# EAGLE design ExosFeather (EAGLE 7.3.0)
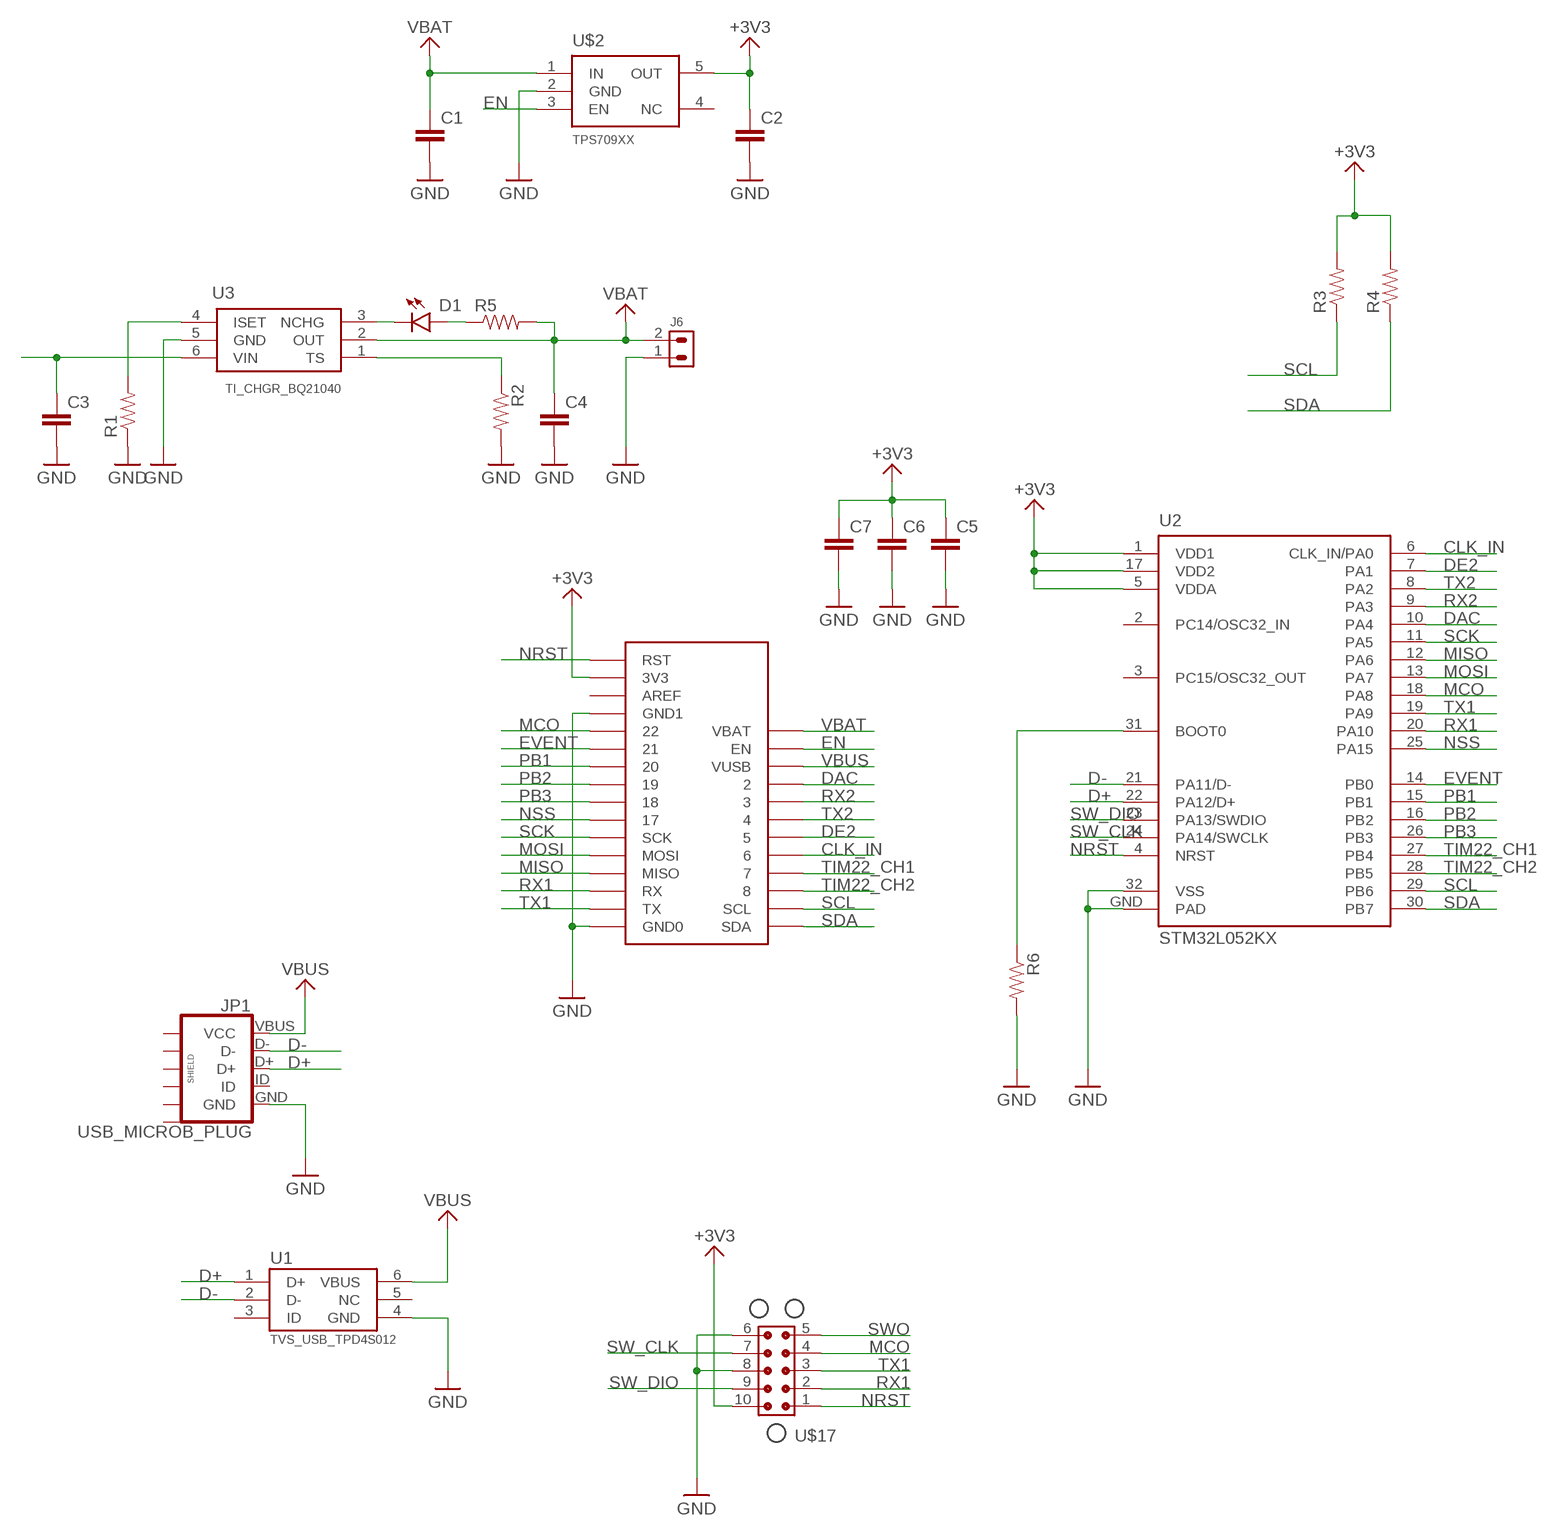
[diagram p0: schematic, sheet 1]

## Parts
C1  0603_CAP  [0603]
C2  0603_CAP  [0603]
C3  0603_CAP  [0603]
C4  0603_CAP  [0603]
C5  0603_CAP  [0603]
C6  0603_CAP  [0603]
C7  0603_CAP  [0603]
D1  0603_LED  [0603_LED]
J6  CONN_2X1_JST_PA  [CONN_2X1_JST_PA]
JP1  USB_MICROB_PLUG  [USB-MICROB]
R1  0603_RES  [0603]
R2  0603_RES  [0603]
R3  0603_RES  [0603]
R4  0603_RES  [0603]
R5  0603_RES  [0603]
R6  0603_RES  [0603]
U1  TVS_USB_TPD4S012  [USB_TVS_TPD4S012]
U2  STM32L052KX  [STM32_QFN_32_5X5]
U3  TI_CHGR_BQ21040  [SOT-23-6_TI]
U$1  FEATHER_PINOUT_FULL  [FEATHER_PINOUT_FULL]
U$2  TPS709XX  [SOT23-5]
U$17  TC_2050_IDC_TOP  [TC_2050_IC_TOP]

## Nets
+3V3: C2.P$1 C5.P$1 C6.P$1 C7.P$1 R3.P$2 R4.P$2 U2.1(VDD1) U2.5(VDDA) U2.17(VDD2) U$1.P$27(3V3) U$2.5(OUT) U$17.10 ; supply symbol labelled SUP_+3V3
CLK_IN: U2.6(CLK_IN/PA0) U$1.P$8
D+: JP1.D+ U1.1(D+) U2.22(PA12/D+)
D-: JP1.D- U1.2(D-) U2.21(PA11/D-)
DAC: U2.10(PA4) U$1.P$4
DE2: U2.7(PA1) U$1.P$7
EN: U$1.P$2(EN) U$2.3(EN)
EVENT: U2.14(PB0) U$1.P$23
GND: C1.P$2 C2.P$2 C3.P$2 C4.P$2 C5.P$2 C6.P$2 C7.P$2 J6.1 JP1.GND R1.P$1 R2.P$2 R6.P$2 U1.4(GND) U2.32(VSS) U2.GND(PAD) U3.5(GND) U$1.P$13(GND0) U$1.P$25(GND1) U$2.2(GND) U$17.6 U$17.8
MCO: U2.18(PA8) U$1.P$24 U$17.4
MISO: U2.12(PA6) U$1.P$16(MISO)
MOSI: U2.13(PA7) U$1.P$17(MOSI)
N$1: R6.P$1 U2.31(BOOT0)
N$3: R2.P$1 U3.1(TS)
N$5: R1.P$2 U3.4(ISET)
N$6: D1.P$2(C) U3.3(NCHG)
N$7: D1.P$1(A) R5.P$1
NRST: U2.4(NRST) U$1.P$28(RST) U$17.1
NSS: U2.25(PA15) U$1.P$19
PB1: U2.15(PB1) U$1.P$22
PB2: U2.16(PB2) U$1.P$21
PB3: U2.26(PB3) U$1.P$20
RX1: U2.20(PA10) U$1.P$15(RX) U$17.2
RX2: U2.9(PA3) U$1.P$5
SCK: U2.11(PA5) U$1.P$18(SCK)
SCL: R3.P$1 U2.29(PB6) U$1.P$11(SCL)
SDA: R4.P$1 U2.30(PB7) U$1.P$12(SDA)
SW_CLK: U2.24(PA14/SWCLK) U$17.7
SW_DIO: U2.23(PA13/SWDIO) U$17.9
SWO: U$17.5
TIM22_CH1: U2.27(PB4) U$1.P$9
TIM22_CH2: U2.28(PB5) U$1.P$10
TX1: U2.19(PA9) U$1.P$14(TX) U$17.3
TX2: U2.8(PA2) U$1.P$6
VBAT: C1.P$1 C4.P$1 J6.2 R5.P$2 U3.2(OUT) U$1.P$1(VBAT) U$2.1(IN) ; supply symbol labelled SUP_VBAT
VBUS: C3.P$1 JP1.VBUS(VCC) U1.6(VBUS) U3.6(VIN) U$1.P$3(VUSB) ; supply symbol labelled SUP_VBUS
Unconnected: JP1.ID JP1.MT1(SHIELD) JP1.MT2(SHIELD1) JP1.P$1(SHIELD2) JP1.P$2(SHIELD3) JP1.P$3(SHIELD4) JP1.P$4(SHIELD5) U1.3(ID) U1.5(NC) U2.2(PC14/OSC32_IN) U2.3(PC15/OSC32_OUT) U$1.P$26(AREF) U$2.4(NC)

## Library data of the parts
C1-C7 = stepOSP:0603_CAP
D1 = stepOSP:0603_LED
J6 = leaf:CONN_2X1_JST_PA
JP1 = stepOSP:USB_MICROB_PLUG: USB Micro-B connectors Some male, some female. Watch your step!
R1-R6 = stepOSP:0603_RES
U1 = leaf:TVS_USB_TPD4S012
U2 = leaf:STM32L052KX
U3 = leaf:TI_CHGR_BQ21040
U$1 = stepOSP:FEATHER_PINOUT_FULL
U$2 = stepOSP:TPS709XX
U$17 = leaf:TC_2050_IDC_TOP

## Board
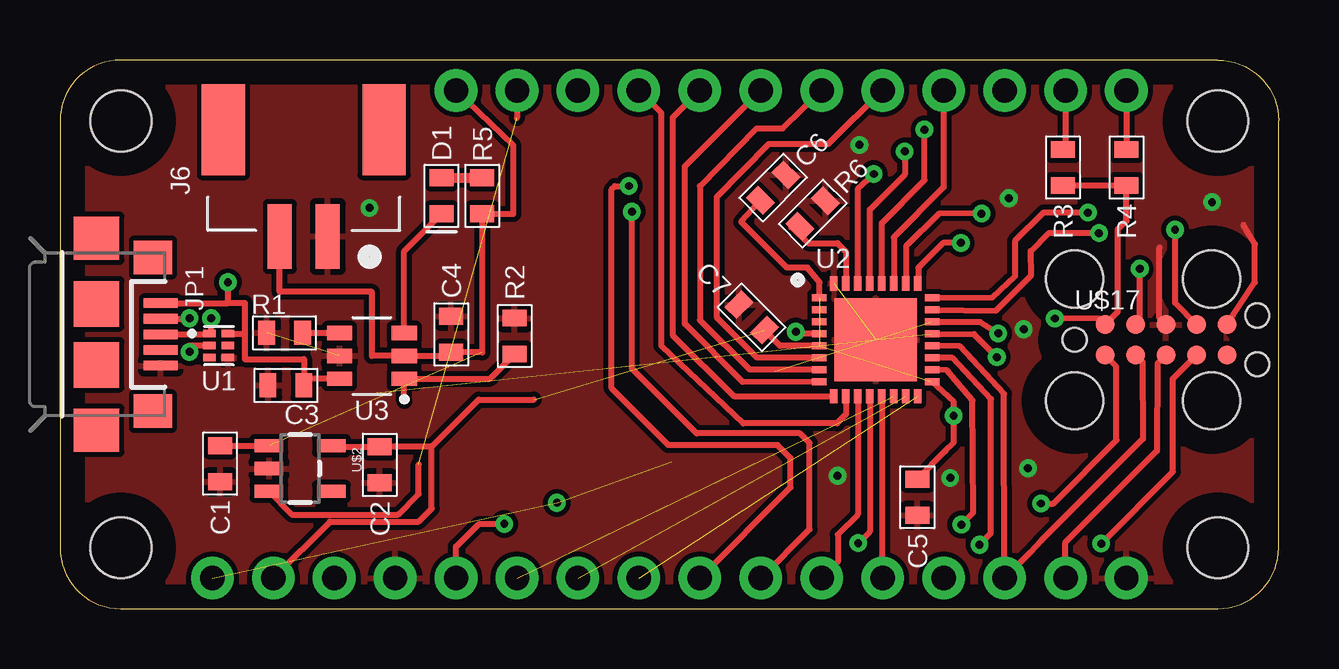
[diagram p1: board, top side]
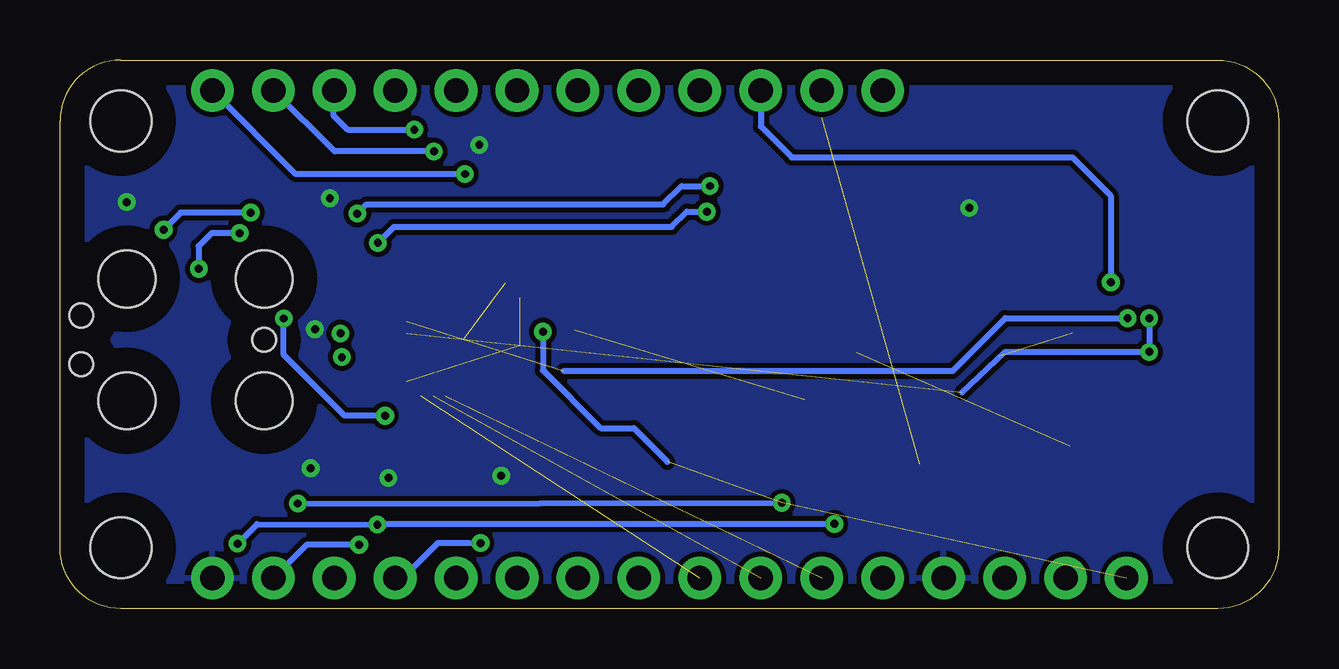
[diagram p2: board, bottom side, seen from below]

Size 50.8 x 22.86 mm. Coordinates in mm from the lower left corner, seen from the top.
Outline: 2.54,0 48.26,0 arc90 50.8,2.54 50.8,20.32 arc90 48.26,22.86 2.54,22.86 arc90 0,20.32 0,2.54 arc90 2.54,0
Copper layers (1*16): Top 0.035mm / dielectric 1.5mm / Bottom 0.035mm
Design rules "default": minimum track width 10mil, minimum drill 24mil, track to track 8mil, track to pad 8mil, pad to pad 8mil, via to via 8mil, smd to smd 8mil, copper to edge 40mil, drill to drill 8mil, minimum pad ring 10mil, minimum via ring 8mil, stop-mask expansion 4mil, vias tented up to drill 0mil, thermal gap 10mil

### Footprints (pad centres in the part's own frame; a part is rotated, then mirrored left to right if it is on the bottom)
0603 = smd 0.7 x 1: P$1 -0.75,0; P$2 0.75,0
0603_LED = smd 0.7 x 1: P$1 -0.75,0; P$2 0.75,0
CONN_2X1_JST_PA = smd 1 x 2.7: 1 1,-9.15; 2 -1,-9.15 | smd 1.8 x 3.8: P$1 3.35,-4.7; P$2 -3.35,-4.7
USB-MICROB = smd 0.4 x 1.4: D+ 0,2.675; D- -0.65,2.675; GND 1.3,2.675; ID 0.65,2.675; VBUS -1.3,2.675 | smd 1.8 x 1.9: MT1 -4,0; MT2 4,0 | smd 1.9 x 1.9: P$1 -1.27,0; P$2 1.27,0 | smd 1.4 x 1.6: P$3 3.2,2.35; P$4 -3.2,2.35
USB_TVS_TPD4S012 = smd 0.52 x 0.3: 1 -0.385,0.5; 2 -0.385,0; 3 -0.385,-0.5; 4 0.385,-0.5; 5 0.385,0; 6 0.385,0.5
STM32_QFN_32_5X5 = smd 0.6 x 0.3: 1 -2.35,1.75; 2 -2.35,1.25; 3 -2.35,0.75; 4 -2.35,0.25; 5 -2.35,-0.25; 6 -2.35,-0.75; 7 -2.35,-1.25; 8 -2.35,-1.75; 17 2.35,-1.75; 18 2.35,-1.25; 19 2.35,-0.75; 20 2.35,-0.25; 21 2.35,0.25; 22 2.35,0.75; 23 2.35,1.25; 24 2.35,1.75 | smd 0.3 x 0.6: 9 -1.75,-2.35; 10 -1.25,-2.35; 11 -0.75,-2.35; 12 -0.25,-2.35; 13 0.25,-2.35; 14 0.75,-2.35; 15 1.25,-2.35; 16 1.75,-2.35; 25 1.75,2.35; 26 1.25,2.35; 27 0.75,2.35; 28 0.25,2.35; 29 -0.25,2.35; 30 -0.75,2.35; 31 -1.25,2.35; 32 -1.75,2.35 | smd 3.45 x 3.45: GND 0,0
SOT-23-6_TI = smd 0.6 x 1.05: 1 -0.95,-1.35; 2 0,-1.35; 3 0.95,-1.35; 4 0.95,1.35; 5 0,1.35; 6 -0.95,1.35
FEATHER_PINOUT_FULL = drill 1.016 pad 1.778: P$1 16.51,21.59; P$2 19.05,21.59; P$3 21.59,21.59; P$4 24.13,21.59; P$5 26.67,21.59; P$6 29.21,21.59; P$7 31.75,21.59; P$8 34.29,21.59; P$9 36.83,21.59; P$10 39.37,21.59; P$11 41.91,21.59; P$12 44.45,21.59; P$13 44.45,1.27; P$14 41.91,1.27; P$15 39.37,1.27; P$16 36.83,1.27; P$17 34.29,1.27; P$18 31.75,1.27; P$19 29.21,1.27; P$20 26.67,1.27; P$21 24.13,1.27; P$22 21.59,1.27; P$23 19.05,1.27; P$24 16.51,1.27; P$25 13.97,1.27; P$26 11.43,1.27; P$27 8.89,1.27; P$28 6.35,1.27 | hole 2.54: 2.54,2.54; 2.54,20.32; 48.26,20.32; 48.26,2.54
SOT23-5 = smd 0.55 x 1.2: 1 -0.95,-1.3; 2 0,-1.3; 3 0.95,-1.3; 4 0.95,1.3; 5 -0.95,1.3
TC_2050_IC_TOP = smd 0.787 x 0.787: 1 -2.54,-0.635; 2 -1.27,-0.635; 3 0,-0.635; 4 1.27,-0.635; 5 2.54,-0.635; 6 2.54,0.635; 7 1.27,0.635; 8 0,0.635; 9 -1.27,0.635; 10 -2.54,0.635 | hole 0.991: -3.81,0; 3.81,1.016; 3.81,-1.016 | hole 2.375: -3.81,2.54; 1.905,2.54; 1.905,-2.54; -3.81,-2.54

### Placement (x,y rotation side)
C1  6.67,6.04 270 top
C2  13.33,5.99 270 top
C3  9.42,9.3 180 top
C4  16.31,11.43 90 top
C5  35.74,4.64 270 top
C6  29.73,17.54 45 top
C7  28.83,12.14 135 top
D1  15.9,17.2 270 top
J6  10.16,24.66 0 top
JP1  1.52,11.43 270 top
R1  9.36,11.49 0 top
R2  18.95,11.36 90 top
R3  41.81,18.38 270 top
R4  44.45,18.38 270 top
R5  17.6,17.2 270 top
R6  31.38,16.46 45 top
U1  6.62,10.96 0 top
U2  34,11.2 0 top
U3  13,10.53 90 top
U$1  0,0 0 top
U$2  10.01,5.84 270 top
U$17  46.1,11.2 0 top

### Tracks (layer width: path | path; a pad name or v marks a point on that pad's centre or on a via)
+3V3  (via drill 0.33)  (3 unrouted)
  Top 0.254: R3.P$2 R4.P$2 44.45,16.16 44.09,15.8 44.09,12.37 U$17.10 43.31,12.08 v41.47,12.09 | U2.17 37.23,8.65 v37.25,8.04 v37.26,8.03 37.26,6.92 36.91,6.57 C5.P$1 | C6.P$1 29.16,16.96 28.39,16.12 30.3,14.21 31.16,14.21 31.66,13.59 U2.1 | U2.5 30.02,10.95 C7.P$1 | U$2.5 11.36,6.74 C2.P$1 15.48,6.74 | U$1.P$27 11.25,3.63 14.95,3.63 15.49,4.17 15.49,6.73 15.48,6.74 | 15.48,6.74 17.45,8.71 19.76,8.71
  Bottom 0.254: v37.25,8.04 38.94,8.04 41.48,10.58 v41.48,12.08 v41.47,12.09
CLK_IN
  Top 0.254: U2.6 29.05,10.46 27.37,12.15 27.37,17.15 29.55,19.37 32.03,19.37 U$1.P$8
D+  (via drill 0.33)  (1 unrouted)
  Top 0.254: JP1.D+ 6.33,11.43 U1.1 6.3,11.46 v6.3,12.1 | U2.22 38.35,11.95 v39.11,11.47
  Bottom 0.254: v6.3,12.1 11.4,12.1 13.6,9.9 29.8,9.9
D-  (via drill 0.33)  (1 unrouted)
  Top 0.254: JP1.D- 5.5,12.08 v5.4,12.1 | U1.2 5.4,10.96 v5.4,10.7 | U2.21 38.1,11.44 v39.05,10.48
  Bottom 0.254: v5.4,12.1 v5.4,10.7 11.4,10.7 13.2,9
DAC
  Top 0.254: U2.10 32.77,8.1 32.39,7.72 28.48,7.72 25.07,10.96 25.07,20.65 U$1.P$4
DE2
  Top 0.254: U2.7 30.47,9.96 28.76,9.96 26.67,12.02 26.67,17.6 29.04,20.01 30.13,20.01 U$1.P$7
EN  (1 unrouted)
  Top 0.254: U$1.P$2 19.05,20.45 | U$2.3 9.68,3.92 14.09,3.92 14.95,4.78 14.95,6.01
EVENT  (1 unrouted)
GND  (via drill 0.33)  (2 unrouted)
  Top 0.254: U$17.8 45.83,12.11 45.83,15.04 | U$17.6 49.81,13.59 49.81,15.2 49.33,15.99
  other vias: 12.9,16.7 39.55,17.1 48.02,16.94 33.32,19.32 37.11,5.45 40.35,5.85 40.17,11.64 32.41,5.54
  pour Top: 0,0 50.8,0 50.8,22.86 0,22.86
  pour Bottom: 0,0 50.8,0 50.8,22.86 0,22.86
MCO  (via drill 0.33)
  Top 0.254: U$17.4 46.38,9.57 46.39,5.71 v43.4,2.71 | v37.57,3.5 38.07,4.01 38.04,8.68 36.96,9.94 U2.18 | U$1.P$24 16.51,2.58 17.47,3.53 v18.52,3.53
  Bottom 0.254: v43.4,2.71 42.59,3.52 v37.57,3.5 37.54,3.53 v18.52,3.53
MISO  (via drill 0.33)
  Top 0.254: U2.12 33.75,3.21 v33.27,2.73
  Bottom 0.254: U$1.P$16 36.51,1.27 35.04,2.74 33.74,2.74 v33.27,2.73
MOSI
  Top 0.254: U2.13 34.25,1.31 U$1.P$17
N$1
  Top 0.254: R6.P$1 30.48,15.89 31.18,15.23 32.41,15.23 32.76,14.88 U2.31
N$3
  Top 0.254: 14.35,8.65 U3.1 17.92,9.58 R2.P$1
N$5
  Top 0.254: R1.P$2 U3.4
N$6
  Top 0.254: U3.3 14.35,14.9 D1.P$2
N$7
  Top 0.406: D1.P$1 R5.P$1
NRST  (via drill 0.33)  (2 unrouted)
  Top 0.254: v40.89,4.38 41.41,4.38 44.04,7.02 44.03,10.1 U$17.1 | U2.4 30.76,11.45 v30.67,11.54
  Bottom 0.254: v40.89,4.38 30.81,4.39 v20.71,4.41 | v30.67,11.54 30.67,9.93 28.26,7.52 26.88,7.52 25.48,6.12
NSS  (via drill 0.33)
  Top 0.254: U2.25 35.78,14.2 36.82,15.24 v37.55,15.24 | U$1.P$19 31.24,3.3 31.24,6.91 30.85,7.3 26.54,7.3 23.84,10 v23.84,16.54
  Bottom 0.254: v37.55,15.24 36.88,15.91 25.3,15.91 24.67,16.54 v23.84,16.54
PB1  (1 unrouted)
PB2  (1 unrouted)
PB3  (via drill 0.33)
  Top 0.254: v38.41,16.46 36.66,16.47 35.27,15.09 U2.26 | U$1.P$20 30.45,5.05 30.45,6.27 29.91,6.81 25.36,6.81 22.99,9.18 22.99,17.47 23.13,17.61 v23.71,17.61
  Bottom 0.254: v38.41,16.46 38.03,16.84 25.66,16.84 24.89,17.61 v23.71,17.61
RX1
  Top 0.254: U2.20 37.52,10.93 39.35,8.95 U$1.P$15 40.44,2.34 40.91,2.84 45.14,7.07 45.12,10.28 U$17.2
RX2
  Top 0.254: U$1.P$5 25.54,20.46 25.54,11.4 28.09,8.85 U2.9
SCK
  Top 0.254: U2.11 33.25,3.92 32.42,3.09 32.42,1.95 U$1.P$18
SCL  (via drill 0.33)
  Top 0.254: U$1.P$11 41.91,19.23 R3.P$1 | U2.29 33.76,16.63 35.21,18.08 v35.21,19.05
  Bottom 0.254: v35.21,19.05 39.35,19.05 U$1.P$11
SDA  (via drill 0.33)
  Top 0.254: U$1.P$12 R4.P$1 | U2.30 33.27,17.5 v33.92,18.11
  Bottom 0.254: v33.92,18.11 40.97,18.11 U$1.P$12
SW_CLK  (via drill 0.33)  (1 unrouted)
  Top 0.254: U$17.7 46.48,12.72 v46.48,15.78 | U2.24 38.86,12.97 39.81,13.86 39.81,15.32 40.99,16.5 v42.85,16.5
  Bottom 0.254: v42.85,16.5 45.77,16.5 v46.48,15.79
SW_DIO  (via drill 0.33)
  Top 0.254: U$17.9 45.01,12.02 v45.01,14.16 | U2.23 39.02,12.42 40.48,13.9 40.46,14.9 41.22,15.66 v43.3,15.66 v43.31,15.65
  Bottom 0.254: v43.31,15.65 44.47,15.65 45.02,15.1 v45.02,14.17 v45.01,14.16
TIM22_CH1
  Top 0.254: U$1.P$9 36.83,17.55 34.75,15.47 U2.27
TIM22_CH2  (via drill 0.33)
  Top 0.254: U2.28 34.26,16.06 36.04,17.85 v36.03,19.96
  Bottom 0.254: U$1.P$10 39.41,20.56 38.81,19.96 v36.03,19.96
TX1  (via drill 0.33)
  Top 0.254: v38.33,2.66 38.8,3.14 38.81,8.73 37.2,10.45 U2.19 | U$17.3 45.74,10.21 45.72,6.57 41.89,2.74 U$1.P$14
  Bottom 0.254: v38.33,2.66 40.52,2.66 U$1.P$14
TX2
  Top 0.254: U2.8 28.46,9.44 26.05,11.87 26.05,18.43 U$1.P$6
VBAT  (1 unrouted)
  Top 0.254: J6.2 9.16,13.2 13,13.2 13,10.53 U3.2 16.41,10.53 C4.P$1 17.6,10.68 R5.P$2 18.9,16.45 18.9,19.3 U$1.P$1 | C1.P$1 U$2.1
VBUS  (via drill 0.33)
  Top 0.254: JP1.VBUS 7,12.73 | U1.6 7.7,11.46 | 7.7,11.46 7.7,10.4 10.17,10.4 C3.P$1 10.17,9.58 U3.6 | 7,12.73 7.71,12.73 7.7,12.72 7.7,11.46 | 7,12.73 v7,13.6
  Bottom 0.254: U$1.P$3 21.59,20.09 20.3,18.8 8.6,18.8 7,17.2 v7,13.6